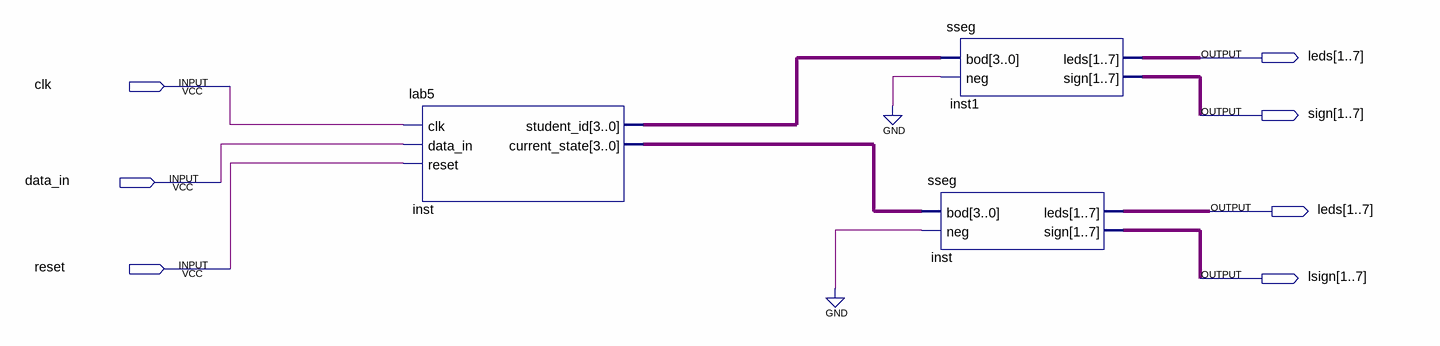
[diagram p0: schematic sheet]
// Quartus schematic Block1.bdf as structural Verilog: 3 symbols, 7 pins
module Block1 (
  input  clk,
  input  data_in,
  input  reset,
  output [1:7] leds,
  output [1:7] sign,
  output [1:7] lsign
);

  wire [3:0] inst_current_state, inst_student_id;

  lab5 inst (
    .clk(clk), .data_in(data_in), .reset(reset), .student_id(inst_student_id),
    .current_state(inst_current_state));
  sseg inst1 (.bod(inst_student_id), .neg(1'b0), .leds(leds), .sign(sign));
  sseg inst_dup2 (.bod(inst_current_state), .neg(1'b0), .leds(leds), .sign(lsign));
endmodule
